# Altium schematic sheet Sheet1.SchDoc
size A4
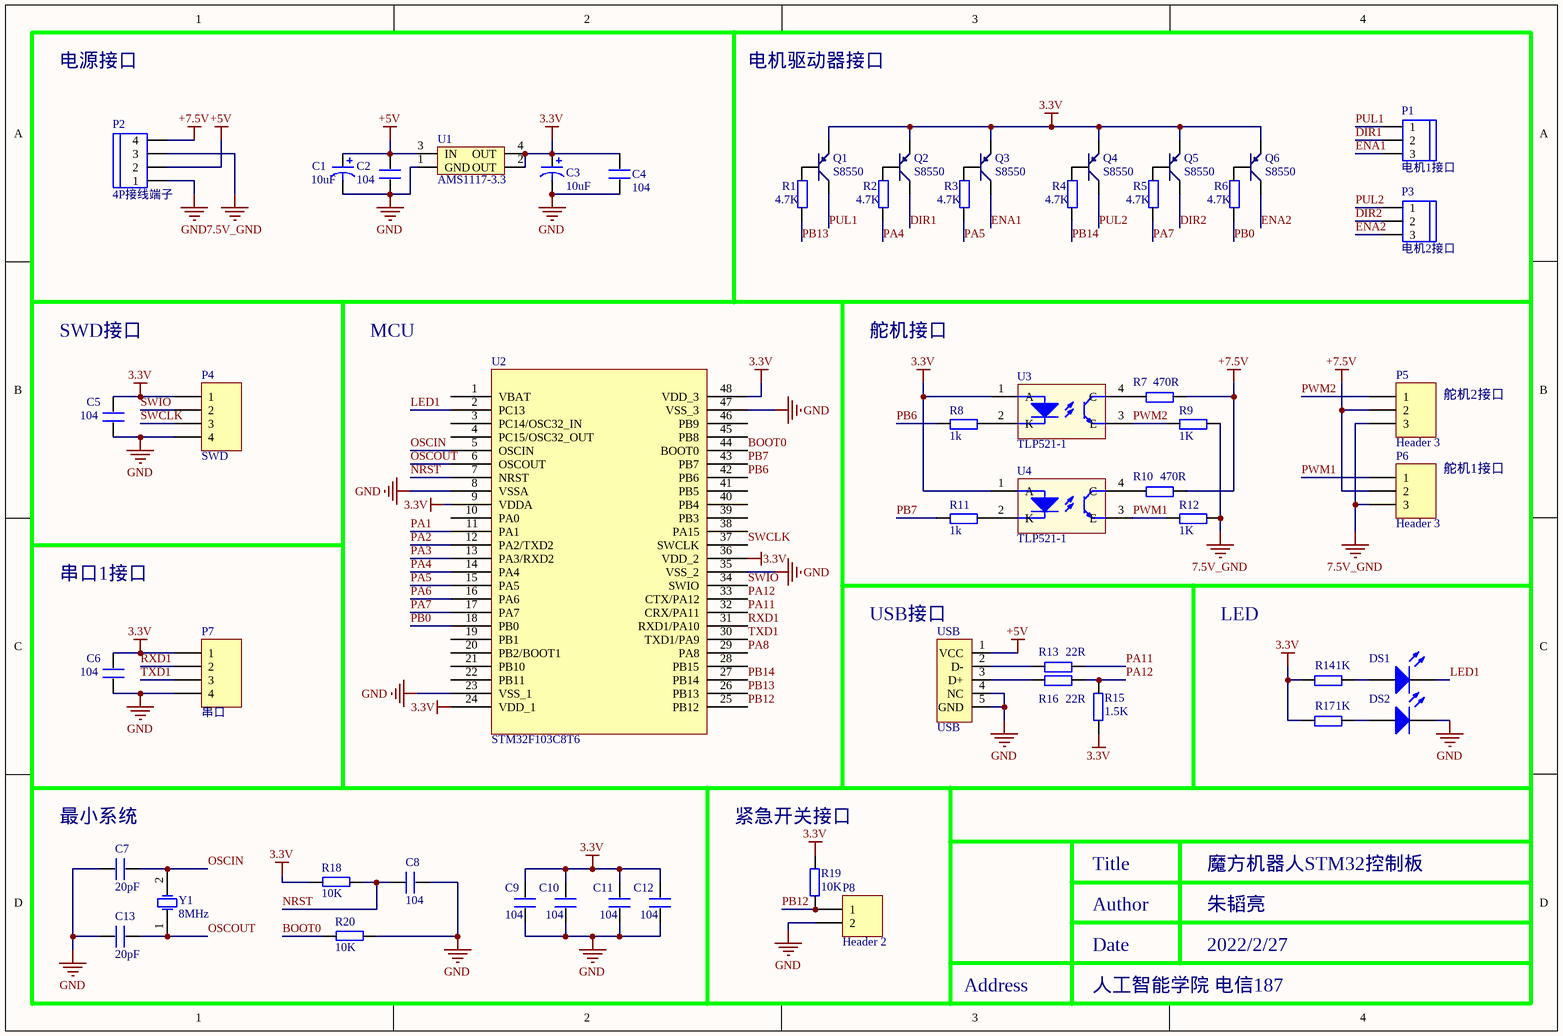
[diagram p0: Sheet1.SchDoc]

## Parts
C1  value 10uF  [钽电容]  (hidden comment: Cap Pol)
C2  104  [0805C]
C3  value 10uF  [钽电容]  (hidden comment: Cap Pol)
C4  104  [0805C]
C5  104  [0805C]
C6  104  [0805C]
C7  20pF  [0805C]
C8  104  [0805C]
C9  104  [0805C]
C10  104  [0805C]
C11  104  [0805C]
C12  104  [0805C]
C13  20pF  [0805C]
DS1  LED1  [SMDLED]  (value not drawn)
DS2  LED1  [SMDLED]  (value not drawn)
P1  电机1接口  [KF301-3P]
P2  4P接线端子  [KF301-4P]
P3  电机2接口  [KF301-3P]
P4  SWD  [HDR1X4]
P5  Header 3  [HDR1X3]
P6  Header 3  [HDR1X3]
P7  串口  [HDR1X4]
P8  Header 2  [HDR1X2]
Q1  S8550  [SOT-23R]
Q2  S8550  [SOT-23R]
Q3  S8550  [SOT-23R]
Q4  S8550  [SOT-23R]
Q5  S8550  [SOT-23R]
Q6  S8550  [SOT-23R]
R1  4.7K  [0805]
R2  4.7K  [0805]
R3  4.7K  [0805]
R4  4.7K  [0805]
R5  4.7K  [0805]
R6  4.7K  [0805]
R7  470R  [0805]
R8  1k  [0805]
R9  1K  [0805]
R10  470R  [0805]
R11  1k  [0805]
R12  1K  [0805]
R13  22R  [0805]
R14  1K  [0805]
R15  1.5K  [0805]
R16  22R  [0805]
R17  1K  [0805]
R18  10K  [0805]
R19  10K  [0805]
R20  10K  [0805]
U1  AMS1117-3.3  [AMS1117]
U2  STM32F103C8T6  [LQF48]
U3  TLP521-1  [SOP-4_(TLP521)]
U4  TLP521-1  [SOP-4_(TLP521)]
USB  USB  [USB/SM0.8-6H5]
Y1  8MHz  [SMD-5032]

## Nets
3.3V: C3.1 C4.2 C5.1 C6.1 C9.1 C10.1 C11.1 C12.1 P4.1 P7.1 Q1.1(E) Q2.1(E) Q3.1(E) Q4.1(E) Q5.1(E) Q6.1(E) R14.1 R15.2 R17.1 R18.2 R19.1 U1.2(OUT) U1.4(OUT) U2.9(VDDA) U2.24(VDD_1) U2.36(VDD_2) U2.48(VDD_3) U3.1(A) U4.1(A)
7.5V_GND: P2.3 P5.3 P6.3 R9.2 R12.2
+5V: C1.1 C2.2 P2.2 U1.3(IN) USB.1(VCC)
+7.5V: P2.4 P5.2 P6.2 R7.2 R10.2
GND: C1.2 C2.1 C3.2 C4.1 C5.2 C6.2 C7.1 C8.2 C9.2 C10.2 C11.2 C12.2 C13.1 DS2.2(K) P2.1 P4.4 P7.4 P8.2 R20.1 U1.1(GND) U2.8(VSSA) U2.23(VSS_1) U2.35(VSS_2) U2.47(VSS_3) USB.4(NC) USB.5(GND)
BOOT0: R20.2 U2.44(BOOT0)
DIR1: P1.2 Q2.3(C)
DIR2: P3.2 Q5.3(C)
ENA1: P1.3 Q3.3(C)
ENA2: P3.3 Q6.3(C)
LED1: DS1.2(K) U2.2(PC13)
NRST: C8.1 R18.1 U2.7(NRST)
OSCIN: C7.2 U2.5(OSCIN) Y1.2
OSCOUT: C13.2 U2.6(OSCOUT) Y1.1
PA1: U2.11(PA1)
PA2: U2.12(PA2/TXD2)
PA3: U2.13(PA3/RXD2)
PA4: R2.1 U2.14(PA4)
PA5: R3.1 U2.15(PA5)
PA6: U2.16(PA6)
PA7: R5.1 U2.17(PA7)
PA8: U2.29(PA8)
PA11: R13.2 U2.32(CRX/PA11)
PA12: R15.1 R16.2 U2.33(CTX/PA12)
PB0: R6.1 U2.18(PB0)
PB6: R8.1 U2.42(PB6)
PB7: R11.1 U2.43(PB7)
PB12: P8.1 R19.2 U2.25(PB12)
PB13: R1.1 U2.26(PB13)
PB14: R4.1 U2.27(PB14)
PUL1: P1.1 Q1.3(C)
PUL2: P3.1 Q4.3(C)
PWM1: P6.1 R12.1 U4.3(E)
PWM2: P5.1 R9.1 U3.3(E)
RXD1: P7.2 U2.31(RXD1/PA10)
SWCLK: P4.3 U2.37(SWCLK)
SWIO: P4.2 U2.34(SWIO)
TXD1: P7.3 U2.30(TXD1/PA9)
NetDS1_1: DS1.1(A) R14.2
NetDS2_1: DS2.1(A) R17.2
NetQ1_2: Q1.2(B) R1.2
NetQ2_2: Q2.2(B) R2.2
NetQ3_2: Q3.2(B) R3.2
NetQ4_2: Q4.2(B) R4.2
NetQ5_2: Q5.2(B) R5.2
NetQ6_2: Q6.2(B) R6.2
NetR7_1: R7.1 U3.4(C)
NetR8_2: R8.2 U3.2(K)
NetR10_1: R10.1 U4.4(C)
NetR11_2: R11.2 U4.2(K)
NetR13_1: R13.1 USB.2(D-)
NetR16_1: R16.1 USB.3(D+)

Not connected (* = marked no-connect by the designer): U2 1(VBAT) 3(PC14/OSC32_IN) 4(PC15/OSC32_OUT) 10(PA0) 19(PB1) 20(PB2/BOOT1) 21(PB10) 22(PB11) 28(PB15) 38(PA15) 39(PB3) 40(PB4) 41(PB5) 45(PB8) 46(PB9)

## Notes on the sheet
- 电源接口
- 电机驱动器接口
- SWD接口
- MCU
- 舵机接口
- (near P5) 舵机2接口
- 舵机1接口
- 串口1接口
- USB接口
- LED
- (near C7) 最小系统
- (near R19) 紧急开关接口
- Title
- Author
- 朱韬亮
- 魔方机器人STM32控制板
- Date
- 2022/2/27
- Address
- 人工智能学院 电信187

## Library data of the parts
C2 C4-C13 = C
DS1 DS2 = LED2: Typical RED, GREEN, YELLOW, AMBER GaAs LED; Published: 8-Jun-2000; LatestRevisionDate: 17-Jul-2002; LatestRevisionNote: Re-released for DXP Platform.; PackageDocument: Feb-2002; PackageReference: 3.2X1.6X1.1; Publisher: Altium Limited
P1 P3 = 3P接线端子
P4 P7 = Header 4: Header, 4-Pin; LatestRevisionDate: 17-Jul-2002; LatestRevisionNote: Re-released for DXP Platform.; Publisher: Altium Limited
P5 P6 = Header 3: Header, 3-Pin; LatestRevisionDate: 17-Jul-2002; LatestRevisionNote: Re-released for DXP Platform.; Publisher: Altium Limited
P8 = Header 2: Header, 2-Pin; LatestRevisionDate: 17-Jul-2002; LatestRevisionNote: Re-released for DXP Platform.; Publisher: Altium Limited
Q1-Q6 = PNP: 8550/BCW68
R1-R20 = R_1
U1 = AMS1117
USB = USB5
Y1 = XTAL